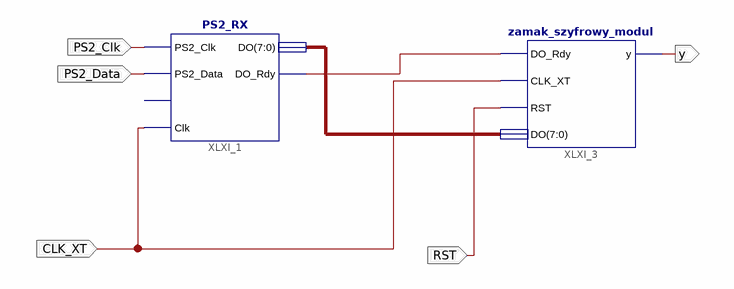
[diagram p0: schematic sheet 1]
// Xilinx ISE schematic zamek_schemat.sch (xc9500xl) as structural Verilog: 2 symbols, 5 ports
module zamek_schemat (
  input  PS2_Clk,
  input  PS2_Data,
  input  CLK_XT,
  input  RST,
  output y
);

  wire XLXN_10;
  wire [7:0] XLXN_12;

  PS2_RX XLXI_1 (.PS2_Clk(PS2_Clk), .PS2_Data(PS2_Data), .Clk(CLK_XT), .DO_Rdy(XLXN_10), .DO(XLXN_12));  // open: Reset
  zamak_szyfrowy_modul XLXI_3 (.DO_Rdy(XLXN_10), .CLK_XT(CLK_XT), .RST(RST), .DO(XLXN_12), .y(y));
endmodule
